# EAGLE schematic main (EAGLE 9.3.0)

## Sheet 1 of 8: ADC
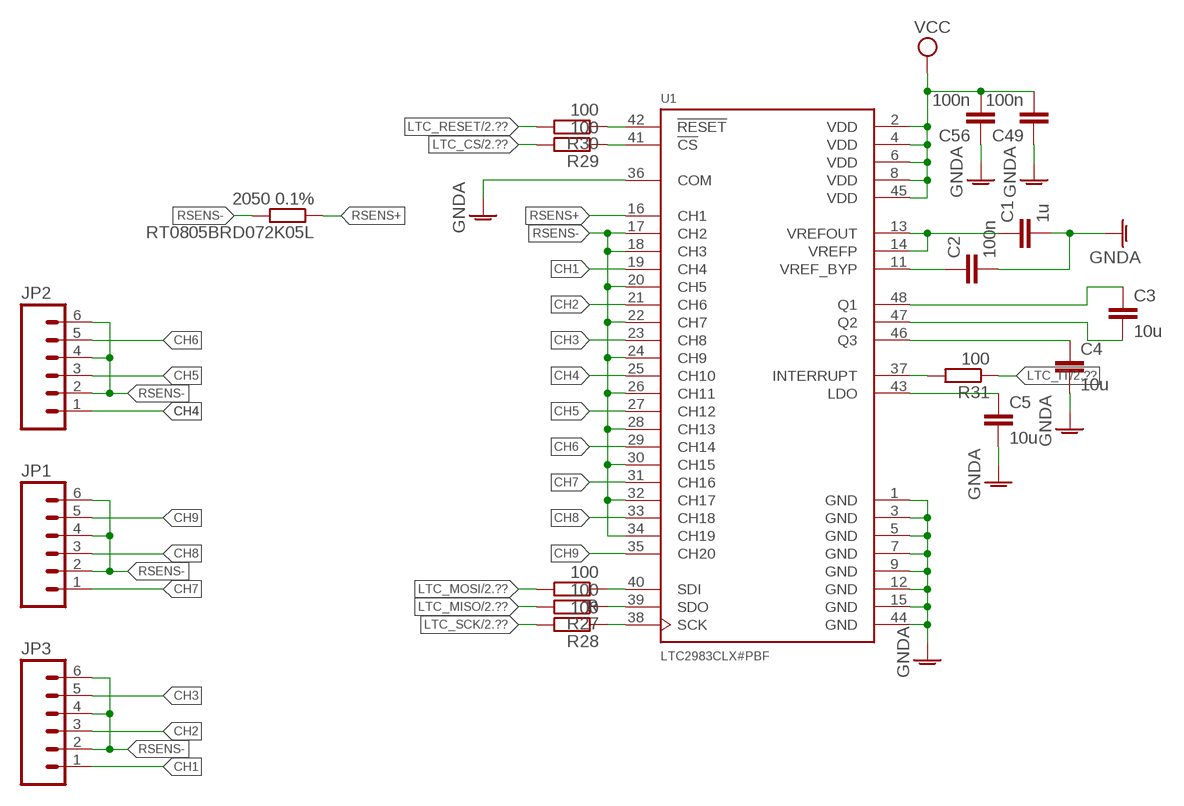
[diagram p0: schematic, sheet 1]

### Parts
C1  1u  C-EUC0603K  [C0603K]
C2  100n  C-EUC0603K  [C0603K]
C3  10u  C-EUC0805K  [C0805K]
C4  10u  C-EUC0805K  [C0805K]
C5  10u  C-EUC0805K  [C0805K]
C49  100n  C-EUC0603K  [C0603K]
C56  100n  C-EUC0603K  [C0603K]
JP1  M063.5MM-6  [SCREWTERMINAL-3.5MM-6]
JP2  M063.5MM-6  [SCREWTERMINAL-3.5MM-6]
JP3  M063.5MM-6  [SCREWTERMINAL-3.5MM-6]
R  100  R-EU_R0603  [R0603]
R27  100  R-EU_R0603  [R0603]
R28  100  R-EU_R0603  [R0603]
R29  100  R-EU_R0603  [R0603]
R30  100  R-EU_R0603  [R0603]
R31  100  R-EU_R0603  [R0603]
RT0805BRD072K05L  2050 0.1%  R-EU_R0805  [R0805]
U1  LTC2983CLX#PBF  [QFP50P900X900X160-48N]

### Nets
CH1: JP3.1 U1.19(CH4)
CH2: JP3.3 U1.21(CH6)
CH3: JP3.5 U1.23(CH8)
CH4: JP2.1 U1.25(CH10)
CH5: JP2.3 U1.27(CH12)
CH6: JP2.5 U1.29(CH14)
CH7: JP1.1 U1.31(CH16)
CH8: JP1.3 U1.33(CH18)
CH9: JP1.5 U1.35(CH20)
GNDA: C1.2 C2.2 C4.2 C5.2 C49.1 C56.1 U1.1(GND) U1.3(GND) U1.5(GND) U1.7(GND) U1.9(GND) U1.12(GND) U1.15(GND) U1.36(COM) U1.44(GND) ; also sheet 2,3,4
LTC_CS: R29.2 ; also sheet 2
LTC_IT: R31.1 ; also sheet 2
LTC_MISO: R27.2 ; also sheet 2
LTC_MOSI: R.2 ; also sheet 2
LTC_RESET: R30.2 ; also sheet 2
LTC_SCK: R28.2 ; also sheet 2
N$1: R31.2 U1.37(INTERRUPT)
N$5: C1.1 U1.13(VREFOUT) U1.14(VREFP)
N$7: C2.1 U1.11(VREF_BYP)
N$11: C3.1 U1.48(Q1)
N$13: C3.2 U1.47(Q2)
N$15: C4.1 U1.46(Q3)
N$17: C5.1 U1.43(LDO)
N$22: R30.1 U1.42(!RESET!)
N$26: R29.1 U1.41(!CS!)
N$27: R.1 U1.40(SDI)
N$41: R27.1 U1.39(SDO)
N$44: R28.1 U1.38(SCK)
RSENS+: RT0805BRD072K05L.1 U1.16(CH1)
RSENS-: JP1.2 JP1.4 JP1.6 JP2.2 JP2.4 JP2.6 JP3.2 JP3.4 JP3.6 RT0805BRD072K05L.2 U1.17(CH2) U1.18(CH3) U1.20(CH5) U1.22(CH7) U1.24(CH9) U1.26(CH11) U1.28(CH13) U1.30(CH15) U1.32(CH17) U1.34(CH19)
VCC: C49.2 C56.2 U1.2(VDD) U1.4(VDD) U1.6(VDD) U1.8(VDD) U1.45(VDD) ; also sheet 2,4

## Sheet 2 of 8: MCU
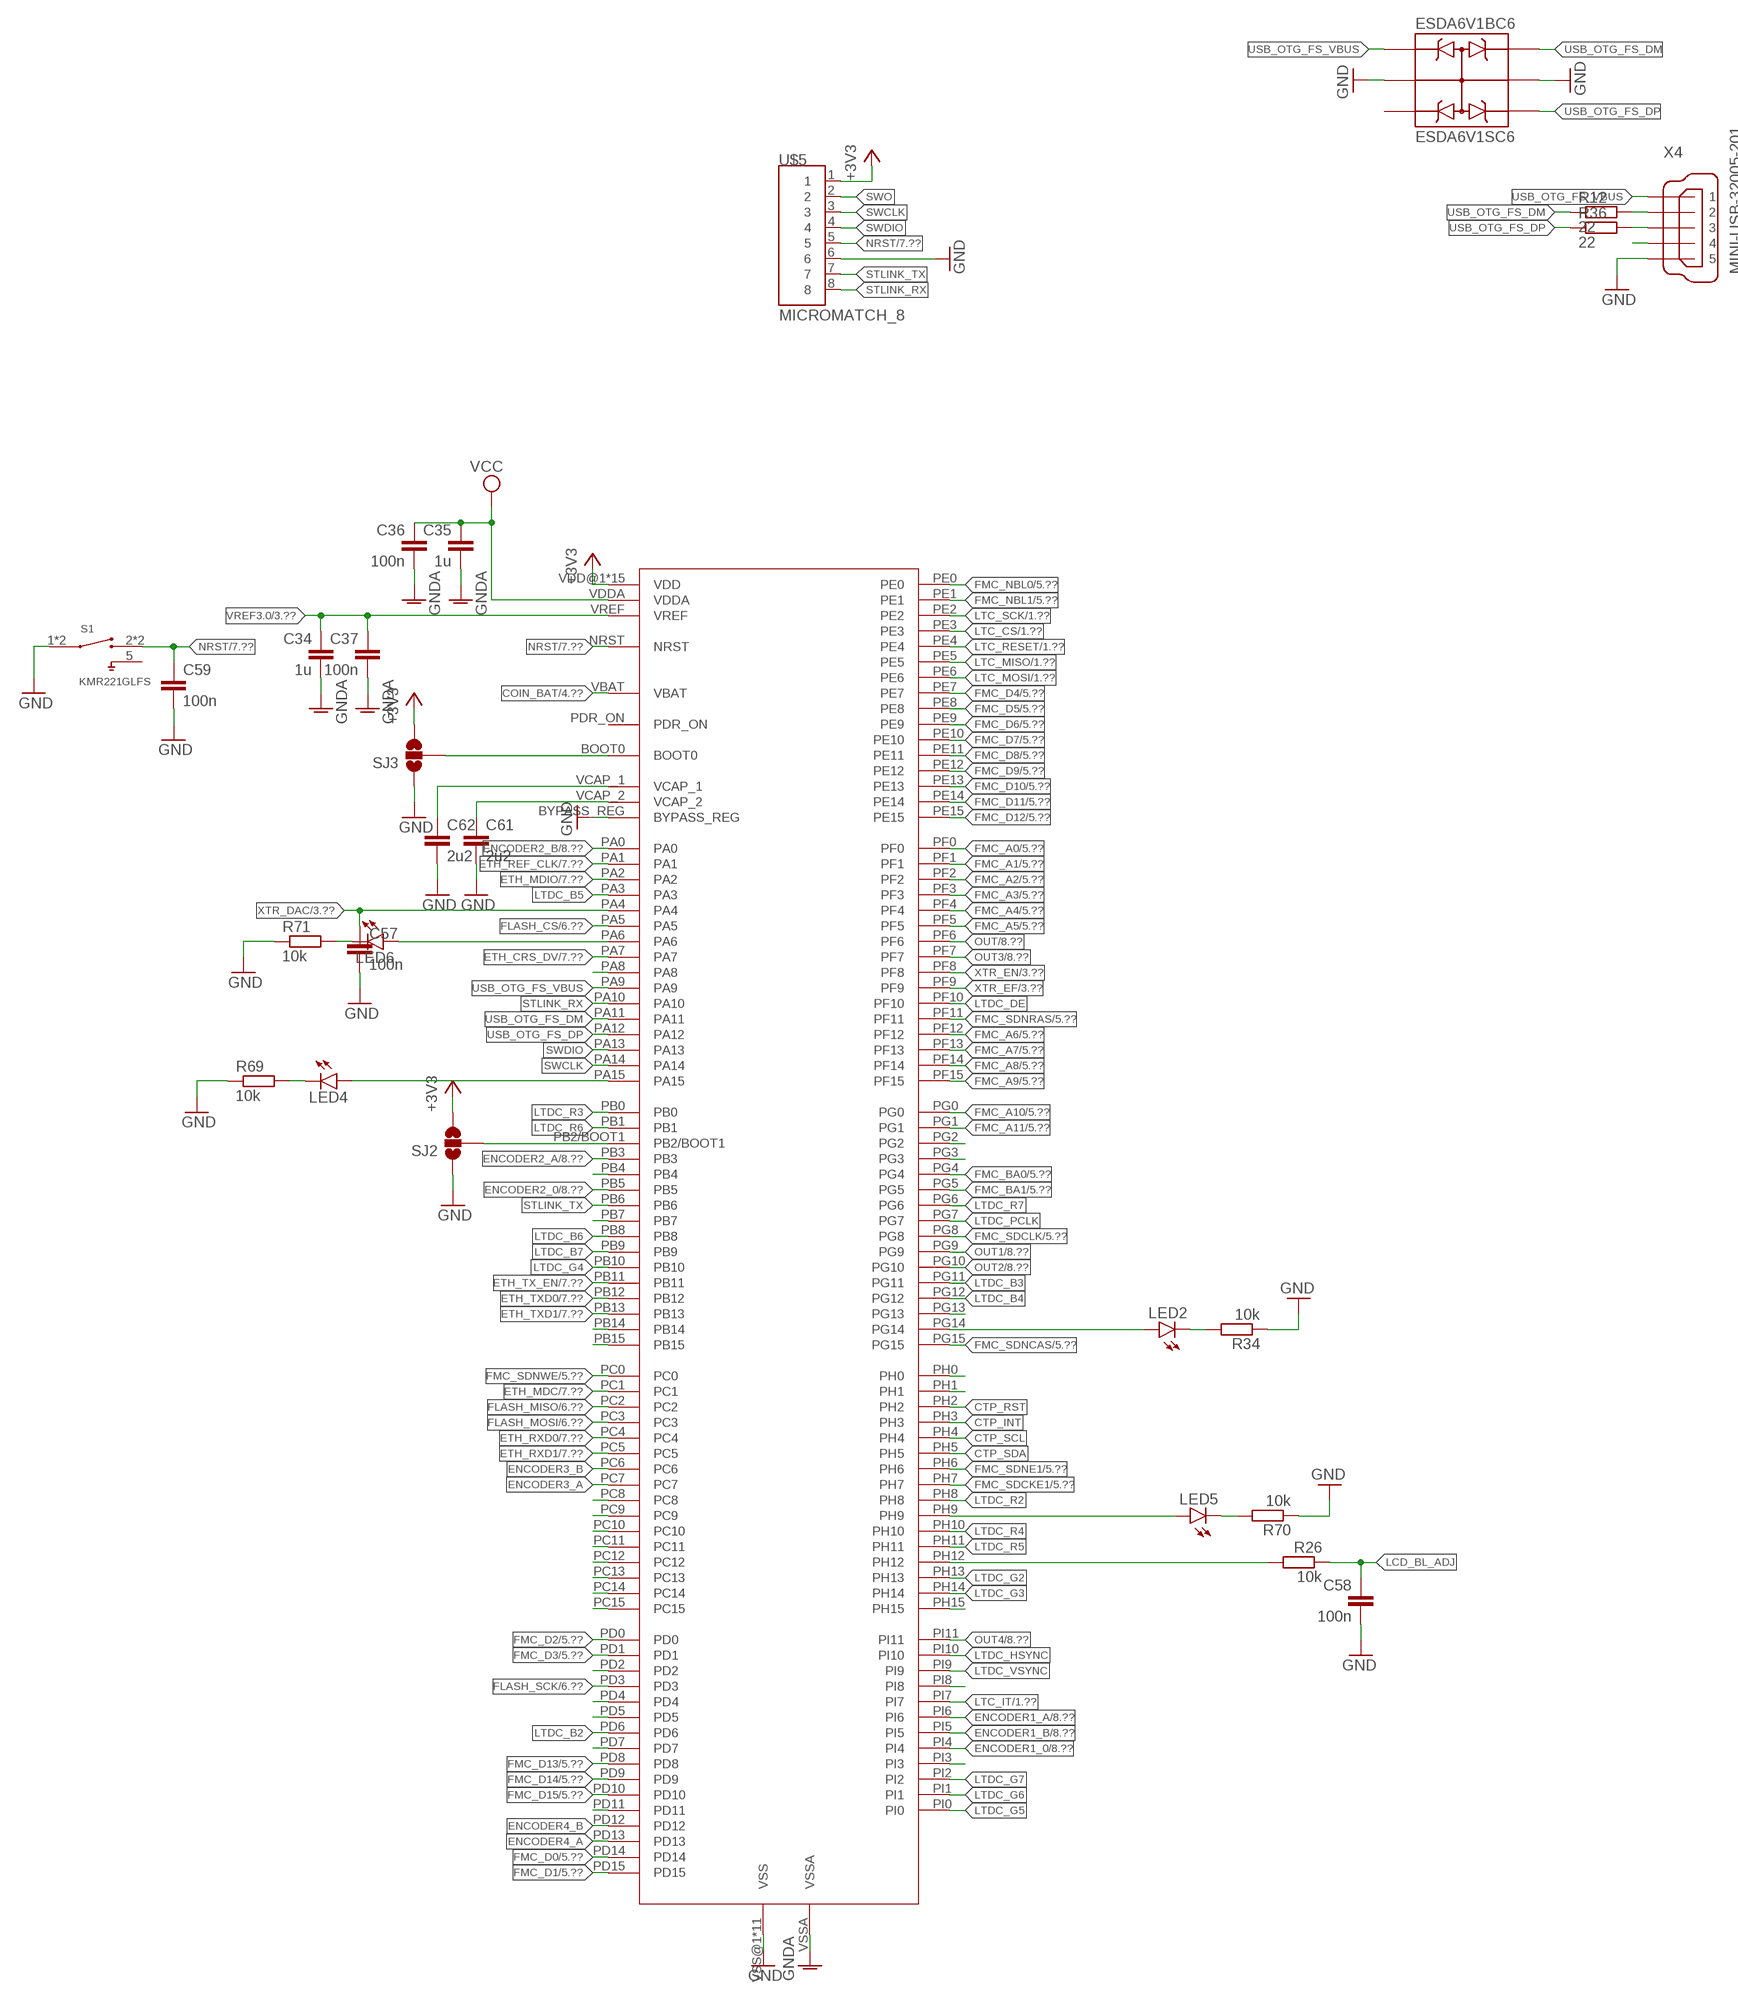
[diagram p1: schematic, sheet 2, part 1 of 2]
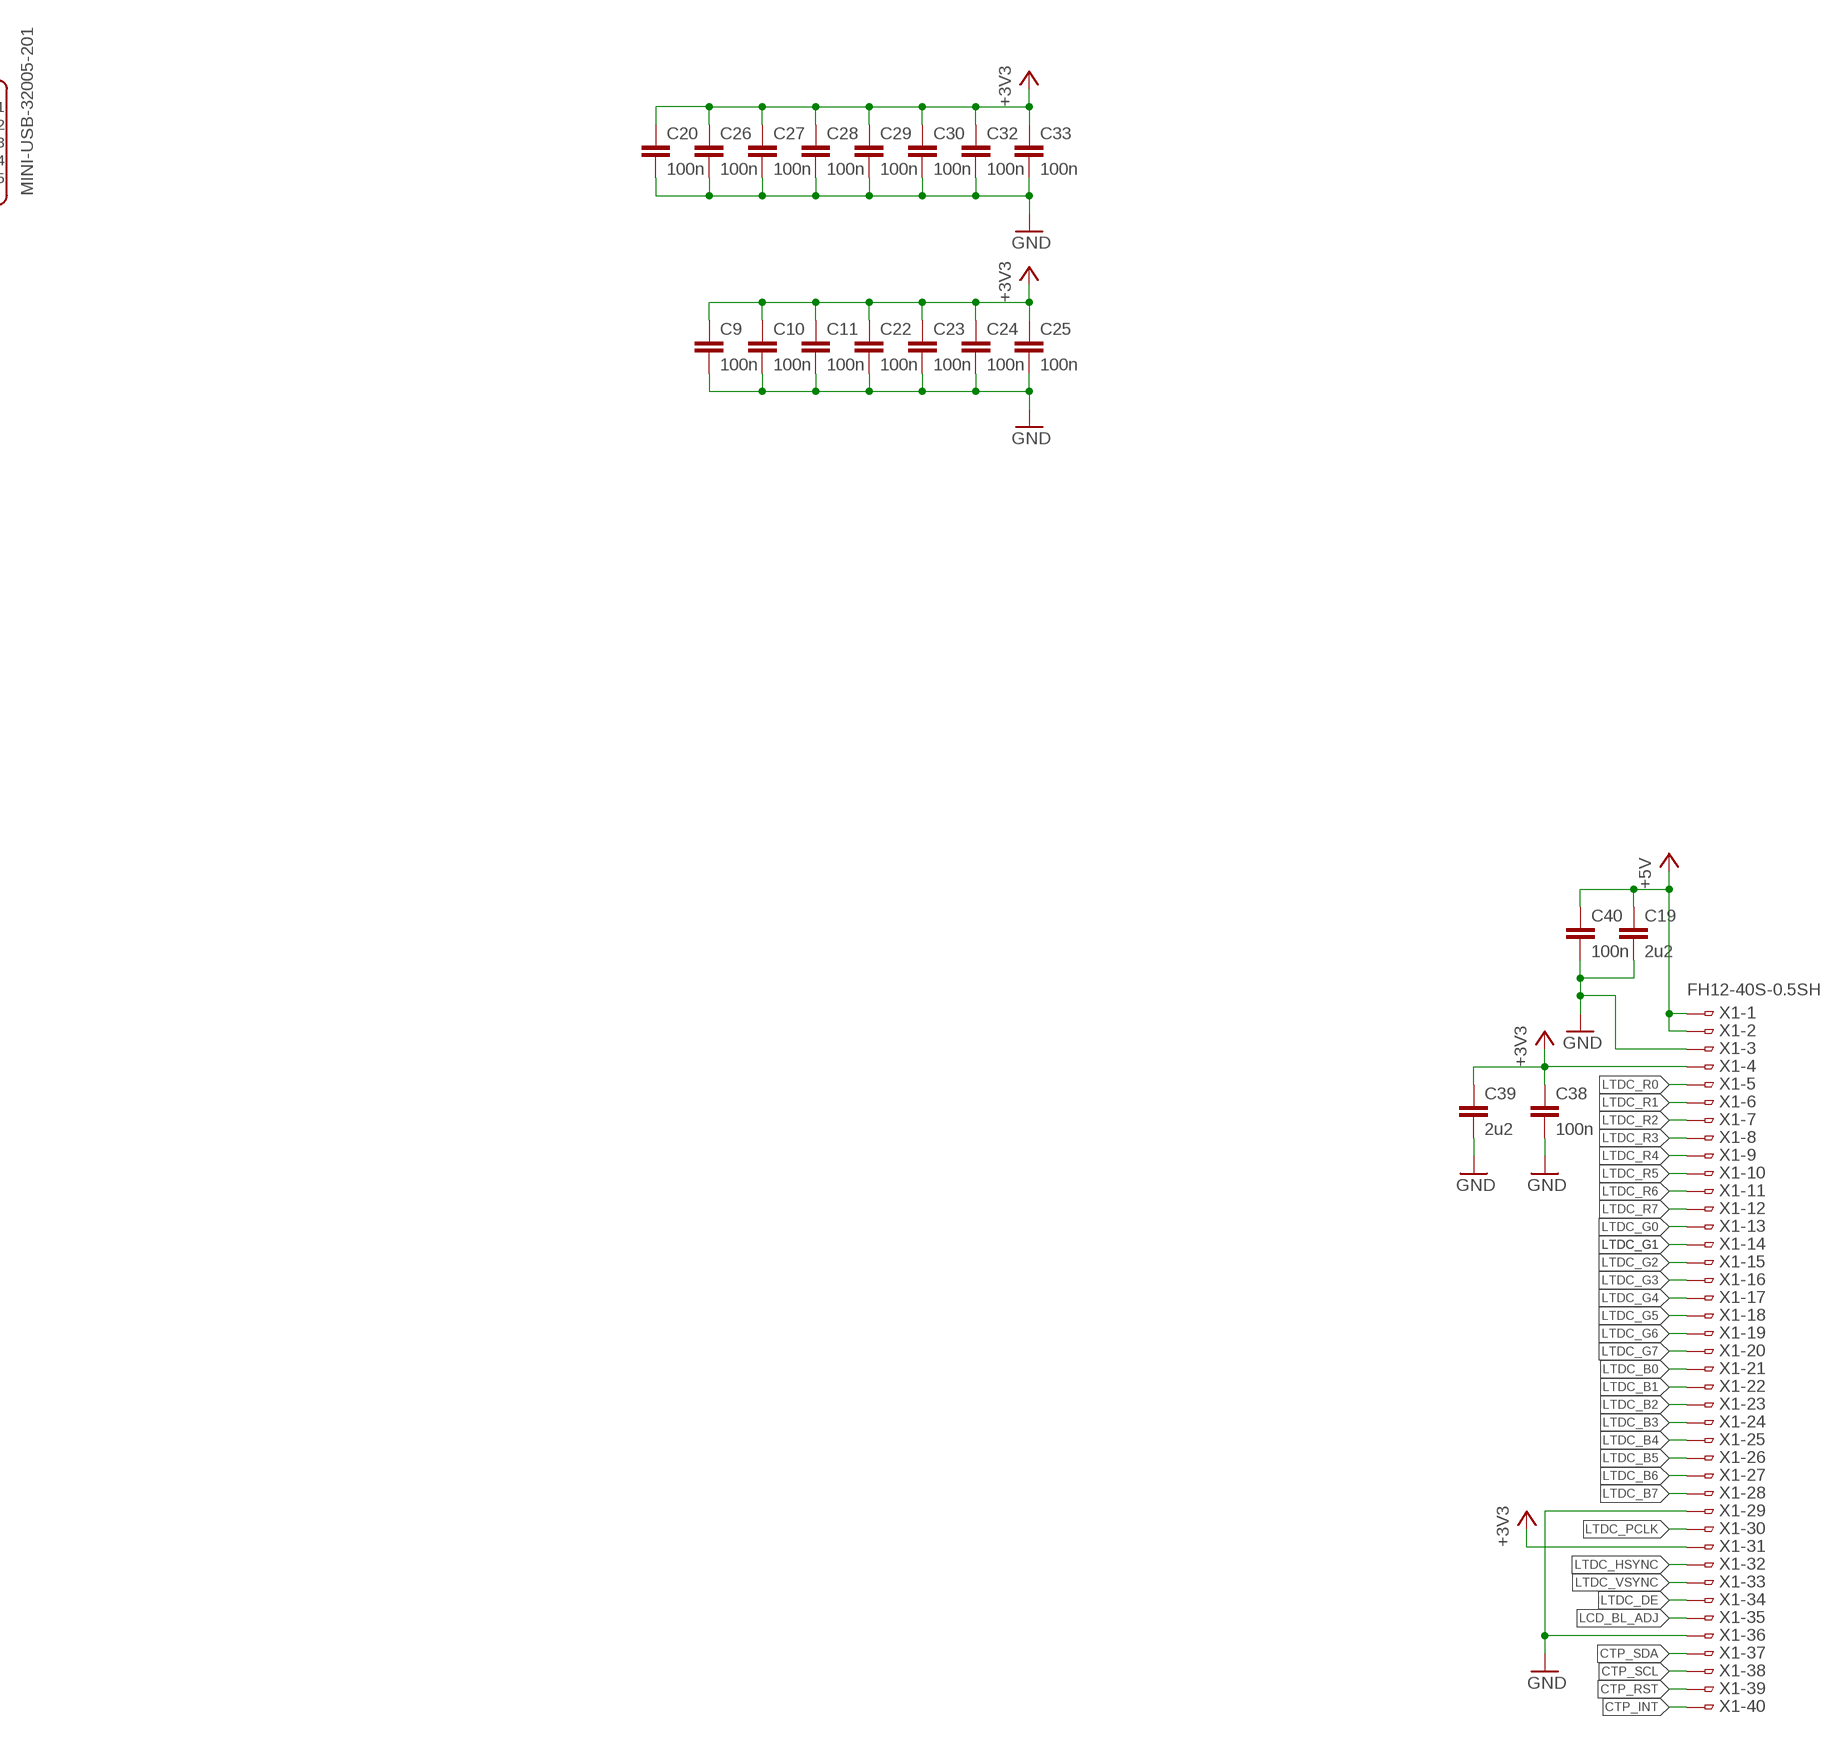
[diagram p2: schematic, sheet 2, part 2 of 2]

### Parts
C9  100n  C-EUC0603K  [C0603K]
C10  100n  C-EUC0603K  [C0603K]
C11  100n  C-EUC0603K  [C0603K]
C19  2u2  C-EUC0805K  [C0805K]
C20  100n  C-EUC0603K  [C0603K]
C22  100n  C-EUC0603K  [C0603K]
C23  100n  C-EUC0603K  [C0603K]
C24  100n  C-EUC0603K  [C0603K]
C25  100n  C-EUC0603K  [C0603K]
C26  100n  C-EUC0603K  [C0603K]
C27  100n  C-EUC0603K  [C0603K]
C28  100n  C-EUC0603K  [C0603K]
C29  100n  C-EUC0603K  [C0603K]
C30  100n  C-EUC0603K  [C0603K]
C32  100n  C-EUC0603K  [C0603K]
C33  100n  C-EUC0603K  [C0603K]
C34  1u  C-EUC0805K  [C0805K]
C35  1u  C-EUC0805K  [C0805K]
C36  100n  C-EUC0603K  [C0603K]
C37  100n  C-EUC0603K  [C0603K]
C38  100n  C-EUC0805  [C0805]
C39  2u2  C-EUC0805K  [C0805K]
C40  100n  C-EUC0805  [C0805]
C57  100n  C-EUC0603K  [C0603K]
C58  100n  C-EUC0603K  [C0603K]
C59  100n  C-EUC0603K  [C0603K]
C61  2u2  C-EUC0805K  [C0805K]
C62  2u2  C-EUC0805K  [C0805K]
ESDA6V1BC6  ESDA6V1SC6  [SOT95P280X145-6N]
LED2  LEDCHIPLED_0603  [CHIPLED_0603]
LED4  LEDCHIPLED_0603  [CHIPLED_0603]
LED5  LEDCHIPLED_0603  [CHIPLED_0603]
LED6  LEDCHIPLED_0603  [CHIPLED_0603]
R12  22  R-EU_R0603  [R0603]
R26  10k  R-EU_R0603  [R0603]
R34  10k  R-EU_R0603  [R0603]
R36  22  R-EU_R0603  [R0603]
R69  10k  R-EU_R0603  [R0603]
R70  10k  R-EU_R0603  [R0603]
R71  10k  R-EU_R0603  [R0603]
S1  KMR221GLFS  [SW_KMR221GLFS]
SJ2  SOLDERJUMPER_2WAYS  [SJ_3]
SJ3  SOLDERJUMPER_2WAYS  [SJ_3]
U$3  STM32F429_176  [QFP50P2600X2600X160-176N]
U$5  MICROMATCH_8  [MICROMATCH_8]
X1  FH12-40S-0.5SH  [FH12-40S-0.5SH]
X4  MINI-USB-32005-201  [32005-201]

### Nets
+3V3: C9.1 C10.1 C11.1 C20.1 C22.1 C23.1 C24.1 C25.1 C26.1 C27.1 C28.1 C29.1 C30.1 C32.1 C33.1 C38.1 C39.1 SJ2.3 SJ3.3 U$3.VDD@1(VDD) U$3.VDD@2(VDD) U$3.VDD@3(VDD) U$3.VDD@4(VDD) U$3.VDD@5(VDD) U$3.VDD@6(VDD) U$3.VDD@7(VDD) U$3.VDD@8(VDD) U$3.VDD@9(VDD) U$3.VDD@10(VDD) U$3.VDD@11(VDD) U$3.VDD@12(VDD) U$3.VDD@13(VDD) U$3.VDD@14(VDD) U$3.VDD@15(VDD) U$5.1 X1.4 X1.31 ; also sheet 4,5,6,7,8
+5V: C19.1 C40.1 X1.1 X1.2 ; also sheet 4,8
COIN_BAT: U$3.VBAT ; also sheet 4
CTP_INT: U$3.PH3 X1.40
CTP_RST: U$3.PH2 X1.39
CTP_SCL: U$3.PH4 X1.38
CTP_SDA: U$3.PH5 X1.37
ENCODER1_0: U$3.PI4 ; also sheet 8
ENCODER1_A: U$3.PI6 ; also sheet 8
ENCODER1_B: U$3.PI5 ; also sheet 8
ENCODER2_0: U$3.PB5 ; also sheet 8
ENCODER2_A: U$3.PB3 ; also sheet 8
ENCODER2_B: U$3.PA0 ; also sheet 8
ENCODER3_A: U$3.PC7
ENCODER3_B: U$3.PC6
ENCODER4_A: U$3.PD13
ENCODER4_B: U$3.PD12
ETH_CRS_DV: U$3.PA7 ; also sheet 7
ETH_MDC: U$3.PC1 ; also sheet 7
ETH_MDIO: U$3.PA2 ; also sheet 7
ETH_REF_CLK: U$3.PA1 ; also sheet 7
ETH_RXD0: U$3.PC4 ; also sheet 7
ETH_RXD1: U$3.PC5 ; also sheet 7
ETH_TX_EN: U$3.PB11 ; also sheet 7
ETH_TXD0: U$3.PB12 ; also sheet 7
ETH_TXD1: U$3.PB13 ; also sheet 7
FLASH_CS: U$3.PA5 ; also sheet 6
FLASH_MISO: U$3.PC2 ; also sheet 6
FLASH_MOSI: U$3.PC3 ; also sheet 6
FLASH_SCK: U$3.PD3 ; also sheet 6
FMC_A0: U$3.PF0 ; also sheet 5
FMC_A1: U$3.PF1 ; also sheet 5
FMC_A2: U$3.PF2 ; also sheet 5
FMC_A3: U$3.PF3 ; also sheet 5
FMC_A4: U$3.PF4 ; also sheet 5
FMC_A5: U$3.PF5 ; also sheet 5
FMC_A6: U$3.PF12 ; also sheet 5
FMC_A7: U$3.PF13 ; also sheet 5
FMC_A8: U$3.PF14 ; also sheet 5
FMC_A9: U$3.PF15 ; also sheet 5
FMC_A10: U$3.PG0 ; also sheet 5
FMC_A11: U$3.PG1 ; also sheet 5
FMC_BA0: U$3.PG4 ; also sheet 5
FMC_BA1: U$3.PG5 ; also sheet 5
FMC_D0: U$3.PD14 ; also sheet 5
FMC_D1: U$3.PD15 ; also sheet 5
FMC_D2: U$3.PD0 ; also sheet 5
FMC_D3: U$3.PD1 ; also sheet 5
FMC_D4: U$3.PE7 ; also sheet 5
FMC_D5: U$3.PE8 ; also sheet 5
FMC_D6: U$3.PE9 ; also sheet 5
FMC_D7: U$3.PE10 ; also sheet 5
FMC_D8: U$3.PE11 ; also sheet 5
FMC_D9: U$3.PE12 ; also sheet 5
FMC_D10: U$3.PE13 ; also sheet 5
FMC_D11: U$3.PE14 ; also sheet 5
FMC_D12: U$3.PE15 ; also sheet 5
FMC_D13: U$3.PD8 ; also sheet 5
FMC_D14: U$3.PD9 ; also sheet 5
FMC_D15: U$3.PD10 ; also sheet 5
FMC_NBL0: U$3.PE0 ; also sheet 5
FMC_NBL1: U$3.PE1 ; also sheet 5
FMC_SDCKE1: U$3.PH7 ; also sheet 5
FMC_SDCLK: U$3.PG8 ; also sheet 5
FMC_SDNCAS: U$3.PG15 ; also sheet 5
FMC_SDNE1: U$3.PH6 ; also sheet 5
FMC_SDNRAS: U$3.PF11 ; also sheet 5
FMC_SDNWE: U$3.PC0 ; also sheet 5
GND: C9.2 C10.2 C11.2 C19.2 C20.2 C22.2 C23.2 C24.2 C25.2 C26.2 C27.2 C28.2 C29.2 C30.2 C32.2 C33.2 C38.2 C39.2 C40.2 C57.2 C58.2 C59.2 C61.2 C62.2 ESDA6V1BC6.2 ESDA6V1BC6.5 R34.1 R69.1 R70.1 R71.1 S1.1 S1.4 SJ2.1 SJ3.1 U$3.BYPASS_REG U$3.VSS@1(VSS) U$3.VSS@2(VSS) U$3.VSS@3(VSS) U$3.VSS@4(VSS) U$3.VSS@5(VSS) U$3.VSS@7(VSS) U$3.VSS@8(VSS) U$3.VSS@9(VSS) U$3.VSS@10(VSS) U$3.VSS@11(VSS) U$3.VSS@12(VSS) U$5.6 X1.3 X1.29 X1.36 X4.5 ; also sheet 3,4,5,6,7,8
GNDA: C34.2 C35.2 C36.2 C37.2 U$3.VSSA ; also sheet 1,3,4
LCD_BL_ADJ: C58.1 R26.1 X1.35
LTC_CS: U$3.PE3 ; also sheet 1
LTC_IT: U$3.PI7 ; also sheet 1
LTC_MISO: U$3.PE5 ; also sheet 1
LTC_MOSI: U$3.PE6 ; also sheet 1
LTC_RESET: U$3.PE4 ; also sheet 1
LTC_SCK: U$3.PE2 ; also sheet 1
LTDC_B0: X1.21
LTDC_B1: X1.22
LTDC_B2: U$3.PD6 X1.23
LTDC_B3: U$3.PG11 X1.24
LTDC_B4: U$3.PG12 X1.25
LTDC_B5: U$3.PA3 X1.26
LTDC_B6: U$3.PB8 X1.27
LTDC_B7: U$3.PB9 X1.28
LTDC_DE: U$3.PF10 X1.34
LTDC_G0: X1.13
LTDC_G1: X1.14
LTDC_G2: U$3.PH13 X1.15
LTDC_G3: U$3.PH14 X1.16
LTDC_G4: U$3.PB10 X1.17
LTDC_G5: U$3.PI0 X1.18
LTDC_G6: U$3.PI1 X1.19
LTDC_G7: U$3.PI2 X1.20
LTDC_HSYNC: U$3.PI10 X1.32
LTDC_PCLK: U$3.PG7 X1.30
LTDC_R0: X1.5
LTDC_R1: X1.6
LTDC_R2: U$3.PH8 X1.7
LTDC_R3: U$3.PB0 X1.8
LTDC_R4: U$3.PH10 X1.9
LTDC_R5: U$3.PH11 X1.10
LTDC_R6: U$3.PB1 X1.11
LTDC_R7: U$3.PG6 X1.12
LTDC_VSYNC: U$3.PI9 X1.33
N$3: LED4.A U$3.PA15
N$28: LED6.A U$3.PA6
N$34: R12.2 X4.2
N$35: R36.2 X4.3
N$36: LED2.A U$3.PG14
N$38: X4.4
N$43: LED4.C R69.2
N$55: LED2.C R34.2
N$58: SJ3.2 U$3.BOOT0
N$59: C62.1 U$3.VCAP_1
N$60: C61.1 U$3.VCAP_2
N$69: U$3.PA8
N$74: LED5.A U$3.PH9
N$78: SJ2.2 U$3.PB2/BOOT1
N$79: U$3.PB4
N$82: U$3.PB7
N$87: LED5.C R70.2
N$89: U$3.PB14
N$90: U$3.PB15
N$93: LED6.C R71.2
N$99: U$3.PC8
N$100: U$3.PC9
N$101: U$3.PC10
N$102: U$3.PC11
N$103: U$3.PC12
N$104: U$3.PC13
N$105: U$3.PC14
N$106: U$3.PC15
N$109: U$3.PD2
N$111: U$3.PD4
N$112: U$3.PD5
N$114: U$3.PD7
N$118: U$3.PD11
N$126: U$3.PI3
N$131: U$3.PI8
N$135: U$3.PH15
N$138: R26.2 U$3.PH12
N$149: U$3.PH1
N$150: U$3.PH0
N$153: U$3.PG13
N$163: U$3.PG3
N$164: U$3.PG2
NRST: C59.1 S1.2 S1.3 U$3.NRST U$5.5 ; also sheet 7
OUT: U$3.PF6 ; also sheet 8
OUT1: U$3.PG9 ; also sheet 8
OUT2: U$3.PG10 ; also sheet 8
OUT3: U$3.PF7 ; also sheet 8
OUT4: U$3.PI11 ; also sheet 8
STLINK_RX: U$3.PA10 U$5.8
STLINK_TX: U$3.PB6 U$5.7
SWCLK: U$3.PA14 U$5.3
SWDIO: U$3.PA13 U$5.4
SWO: U$5.2
USB_OTG_FS_DM: ESDA6V1BC6.6 R12.1 U$3.PA11
USB_OTG_FS_DP: ESDA6V1BC6.4 R36.1 U$3.PA12
USB_OTG_FS_VBUS: ESDA6V1BC6.1 U$3.PA9 X4.1
VCC: C35.1 C36.1 U$3.VDDA ; also sheet 1,4
VREF3.0: C34.1 C37.1 U$3.VREF ; also sheet 3
XTR_DAC: C57.1 U$3.PA4 ; also sheet 3
XTR_EF: U$3.PF9 ; also sheet 3
XTR_EN: U$3.PF8 ; also sheet 3
Unconnected: ESDA6V1BC6.3 S1.5 U$3.PDR_ON

## Sheet 3 of 8: current
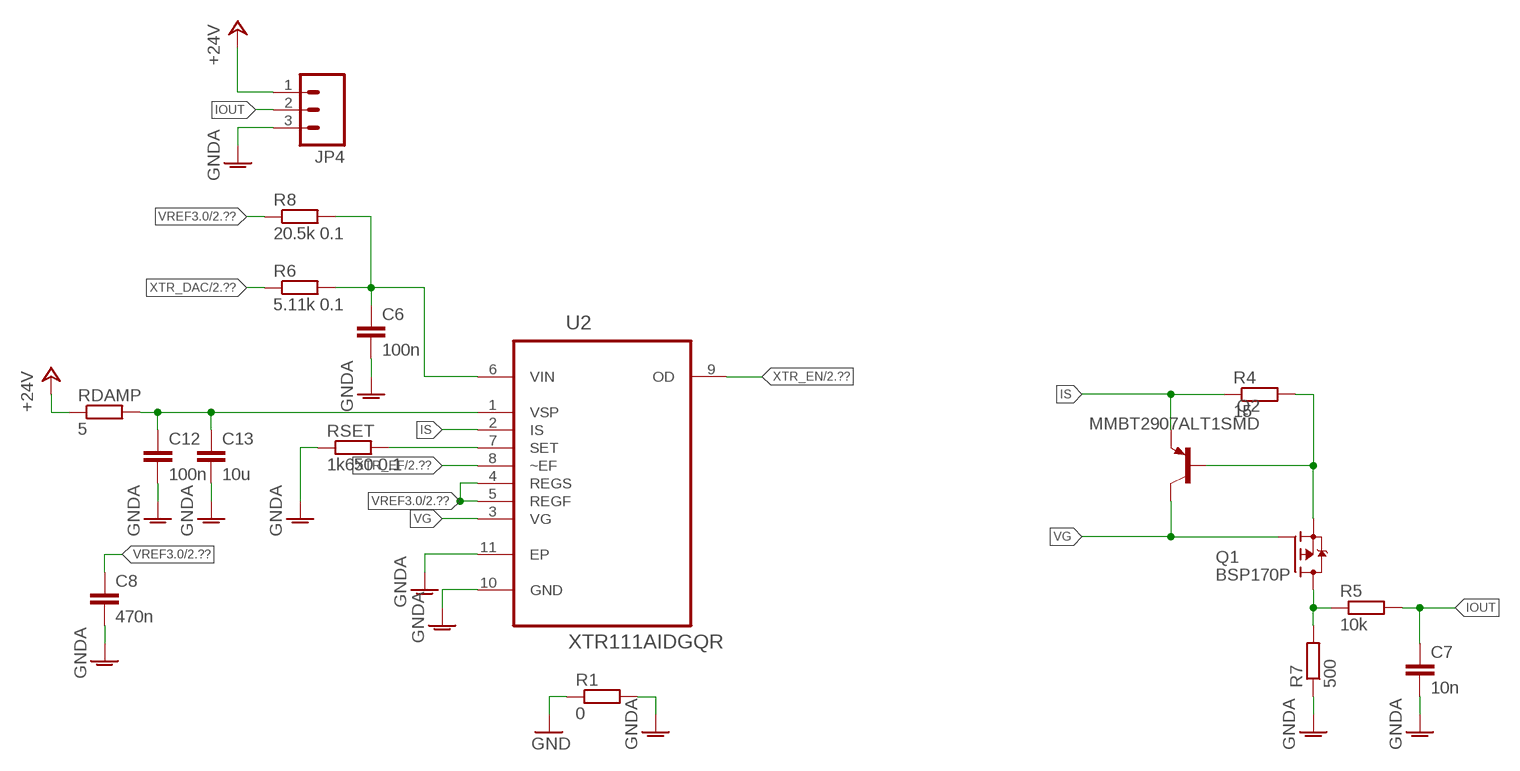
[diagram p3: schematic, sheet 3]

### Parts
C6  100n  C-EUC0603K  [C0603K]
C7  10n  C-EUC0603K  [C0603K]
C8  470n  C-EUC0603K  [C0603K]
C12  100n  C-EUC0603K  [C0603K]
C13  10u  C-EUC0805  [C0805]
JP4  M03SCREW  [SCREWTERMINAL-3.5MM-3]
Q1  BSP170P  [SOT223]
Q2  MMBT2907ALT1SMD  [SOT23-BEC]
R1  0  R-EU_R0603  [R0603]
R4  15  R-EU_R0603  [R0603]
R5  10k  R-EU_R0603  [R0603]
R6  5.11k 0.1  R-EU_R0805  [R0805]
R7  500  R-EU_R0603  [R0603]
R8  20.5k 0.1  R-EU_R0805  [R0805]
RDAMP  5  R-EU_R0603  [R0603]
RSET  1k650 0.1  R-EU_R0805  [R0805]
U2  XTR111AIDGQR  [SOP50P490X120-15N]

### Nets
+24V: JP4.1 RDAMP.1 ; also sheet 4
GND: R1.1 ; also sheet 2,4,5,6,7,8
GNDA: C6.2 C7.2 C8.2 C12.2 C13.2 JP4.3 R1.2 R7.1 RSET.1 U2.10(GND) U2.11(EP) ; also sheet 1,2,4
IOUT: C7.1 JP4.2 R5.2
IS: Q2.E R4.1 U2.2(IS)
N$9: Q1.3(S) Q2.B R4.2
N$19: C12.1 C13.1 RDAMP.2 U2.1(VSP)
N$23: Q1.2(D) Q1.4(D) R5.1 R7.2
N$24: RSET.2 U2.7(SET)
N$37: C6.1 R6.2 R8.2 U2.6(VIN)
VG: Q1.1(G) Q2.C U2.3(VG)
VREF3.0: C8.1 R8.1 U2.4(REGS) U2.5(REGF) ; also sheet 2
XTR_DAC: R6.1 ; also sheet 2
XTR_EF: U2.8(~EF) ; also sheet 2
XTR_EN: U2.9(OD) ; also sheet 2

## Sheet 4 of 8: supply
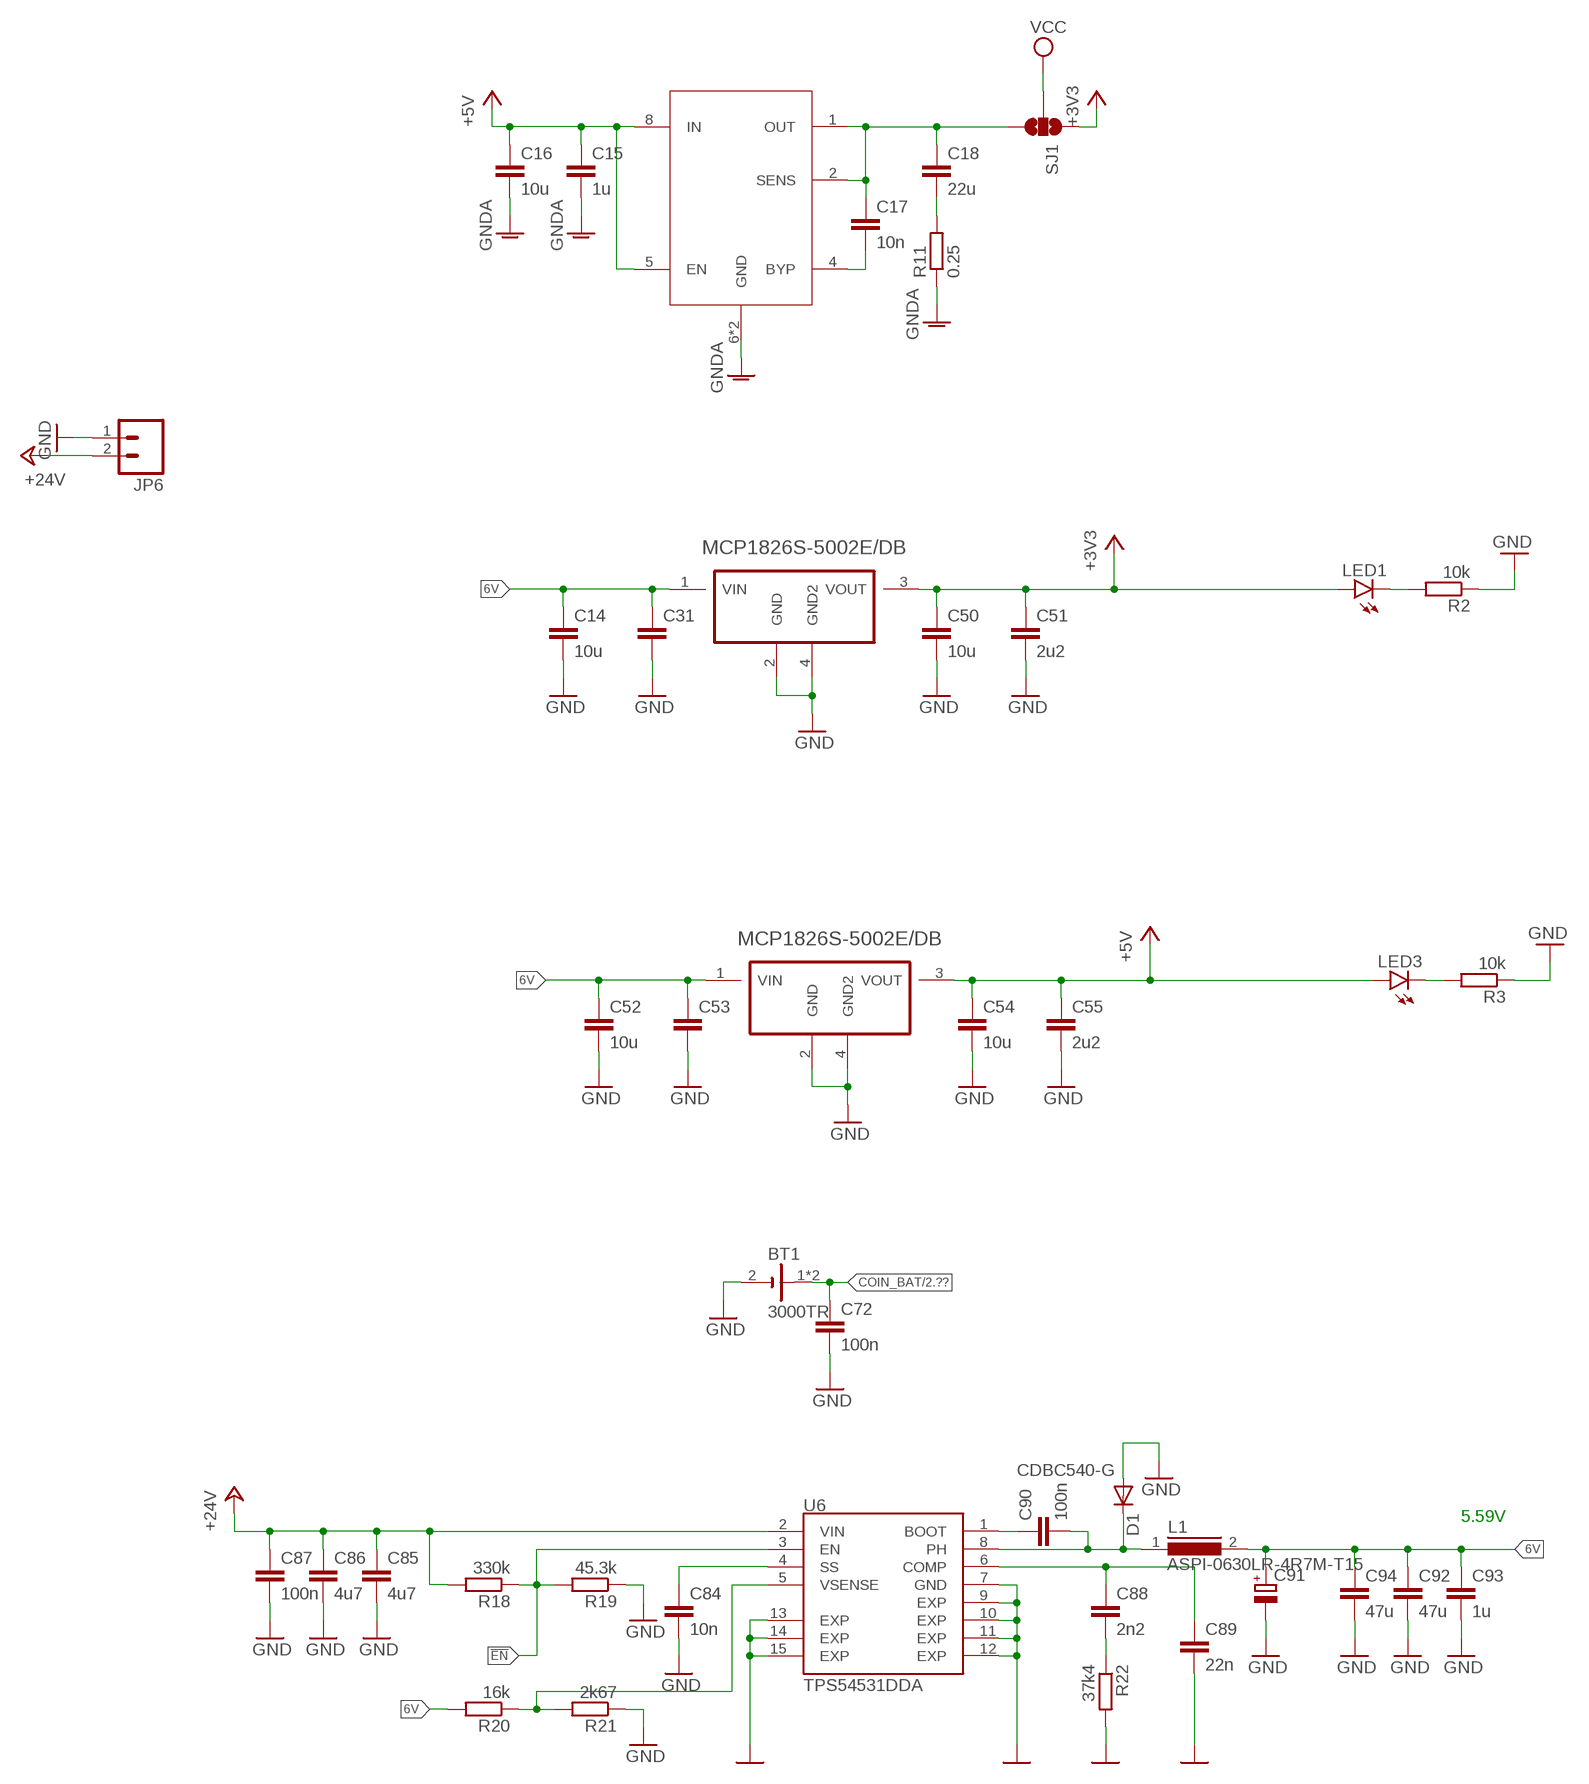
[diagram p4: schematic, sheet 4]

### Parts
BT1  3000TR  [BAT_3000TR]
C14  10u  C-EUC0805K  [C0805K]
C15  1u  C-EUC0805  [C0805]
C16  10u  C-EUC0805  [C0805]
C17  10n  C-EUC0603K  [C0603K]
C18  22u  C-EUC1206  [C1206]
C31  C-EUC0805K  [C0805K]
C50  10u  C-EUC0805K  [C0805K]
C51  2u2  C-EUC0805K  [C0805K]
C52  10u  C-EUC0805K  [C0805K]
C53  C-EUC0805K  [C0805K]
C54  10u  C-EUC0805K  [C0805K]
C55  2u2  C-EUC0805K  [C0805K]
C72  100n  C-EUC0603K  [C0603K]
C84  10n  C-EUC0603K  [C0603K]
C85  4u7  C-EUC0805K  [C0805K]
C86  4u7  C-EUC0805K  [C0805K]
C87  100n  C-EUC0603K  [C0603K]
C88  2n2  C-EUC0603K  [C0603K]
C89  22n  C-EUC0603K  [C0603K]
C90  100n  C-EUC0603K  [C0603K]
C91  CPOL-EUE5-6  [E5-6]
C92  47u  C-EUC1210  [C1210]
C93  1u  C-EUC0603K  [C0603K]
C94  47u  C-EUC1210  [C1210]
D1  CDBC540-G  DIODE-SMB  [SMB]
JP6  M023.5MM-NO_SILK  [SCREWTERMINAL-3.5MM-2-NS]
L1  ASPI-0630LR-4R7M-T15  DR74  [DR74]
LED1  LEDCHIPLED_0603  [CHIPLED_0603]
LED3  LEDCHIPLED_0603  [CHIPLED_0603]
R2  10k  R-EU_R0603  [R0603]
R3  10k  R-EU_R0603  [R0603]
R11  0.25  R-EU_R0603  [R0603]
R18  330k  R-EU_R0603  [R0603]
R19  45.3k  R-EU_R0603  [R0603]
R20  16k  R-EU_R0603  [R0603]
R21  2k67  R-EU_R0603  [R0603]
R22  37k4  R-EU_R0603  [R0603]
SJ1  SOLDERJUMPER_2WAYS  [SJ_3]
U3  MCP1826S-5002E/DB  [SOT230P700X180-4N]
U5  MCP1826S-5002E/DB  [SOT230P700X180-4N]
U6  TPS54531DDA  [SOIC127P600X170-9N]
U$2  IFX5444  [SOIC8]

### Nets
6V: C14.1 C31.1 C52.1 C53.1 C91.+ C92.1 C93.1 C94.1 L1.2 R20.2 U3.1(VIN) U5.1(VIN)
!EN: R18.1 R19.2 U6.3(EN)
+3V3: C50.1 C51.1 LED1.A SJ1.1 U3.3(VOUT) ; also sheet 2,5,6,7,8
+5V: C15.1 C16.1 C54.1 C55.1 LED3.A U5.3(VOUT) U$2.5(EN) U$2.8(IN) ; also sheet 2,8
+24V: C85.1 C86.1 C87.1 JP6.2 R18.2 U6.2(VIN) ; also sheet 3
COIN_BAT: BT1.1(+) BT1.3(+) C72.1 ; also sheet 2
GND: BT1.2(-) C14.2 C31.2 C50.2 C51.2 C52.2 C53.2 C54.2 C55.2 C72.2 C84.2 C85.2 C86.2 C87.2 C89.2 C91.- C92.2 C93.2 C94.2 D1.A JP6.1 R2.1 R3.1 R19.1 R21.1 R22.2 U3.2(GND) U3.4(GND2) U5.2(GND) U5.4(GND2) U6.7(GND) U6.9(EXP) U6.10(EXP) U6.11(EXP) U6.12(EXP) U6.13(EXP) U6.14(EXP) U6.15(EXP) ; also sheet 2,3,5,6,7,8
GNDA: C15.2 C16.2 R11.1 U$2.6(GND) U$2.E(GND) ; also sheet 1,2,3
N$25: C18.2 R11.2
N$31: C17.2 U$2.4(BYP)
N$32: C17.1 C18.1 SJ1.3 U$2.1(OUT) U$2.2(SENS)
N$42: LED1.C R2.2
N$47: R20.1 R21.2 U6.5(VSENSE)
N$48: C84.1 U6.4(SS)
N$49: C88.1 C89.1 U6.6(COMP)
N$50: C88.2 R22.1
N$51: C90.1 U6.1(BOOT)
N$52: C90.2 D1.C L1.1 U6.8(PH)
N$86: LED3.C R3.2
VCC: SJ1.2 ; also sheet 1,2

### Notes on the sheet
- 5.59V

## Sheet 5 of 8
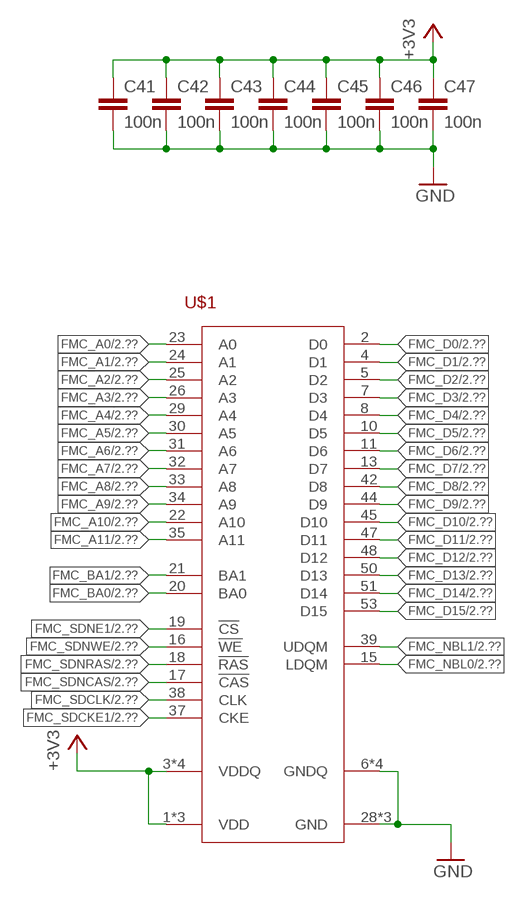
[diagram p5: schematic, sheet 5]

### Parts
C41  100n  C-EUC0603K  [C0603K]
C42  100n  C-EUC0603K  [C0603K]
C43  100n  C-EUC0603K  [C0603K]
C44  100n  C-EUC0603K  [C0603K]
C45  100n  C-EUC0603K  [C0603K]
C46  100n  C-EUC0603K  [C0603K]
C47  100n  C-EUC0603K  [C0603K]
U$1  IS45S16400J  [TSOP54]

### Nets
+3V3: C41.1 C42.1 C43.1 C44.1 C45.1 C46.1 C47.1 U$1.1(VDD) U$1.3(VDDQ) U$1.9(VDDQ) U$1.14(VDD) U$1.27(VDD) U$1.43(VDDQ) U$1.49(VDDQ) ; also sheet 2,4,6,7,8
FMC_A0: U$1.23(A0) ; also sheet 2
FMC_A1: U$1.24(A1) ; also sheet 2
FMC_A2: U$1.25(A2) ; also sheet 2
FMC_A3: U$1.26(A3) ; also sheet 2
FMC_A4: U$1.29(A4) ; also sheet 2
FMC_A5: U$1.30(A5) ; also sheet 2
FMC_A6: U$1.31(A6) ; also sheet 2
FMC_A7: U$1.32(A7) ; also sheet 2
FMC_A8: U$1.33(A8) ; also sheet 2
FMC_A9: U$1.34(A9) ; also sheet 2
FMC_A10: U$1.22(A10) ; also sheet 2
FMC_A11: U$1.35(A11) ; also sheet 2
FMC_BA0: U$1.20(BA0) ; also sheet 2
FMC_BA1: U$1.21(BA1) ; also sheet 2
FMC_D0: U$1.2(D0) ; also sheet 2
FMC_D1: U$1.4(D1) ; also sheet 2
FMC_D2: U$1.5(D2) ; also sheet 2
FMC_D3: U$1.7(D3) ; also sheet 2
FMC_D4: U$1.8(D4) ; also sheet 2
FMC_D5: U$1.10(D5) ; also sheet 2
FMC_D6: U$1.11(D6) ; also sheet 2
FMC_D7: U$1.13(D7) ; also sheet 2
FMC_D8: U$1.42(D8) ; also sheet 2
FMC_D9: U$1.44(D9) ; also sheet 2
FMC_D10: U$1.45(D10) ; also sheet 2
FMC_D11: U$1.47(D11) ; also sheet 2
FMC_D12: U$1.48(D12) ; also sheet 2
FMC_D13: U$1.50(D13) ; also sheet 2
FMC_D14: U$1.51(D14) ; also sheet 2
FMC_D15: U$1.53(D15) ; also sheet 2
FMC_NBL0: U$1.15(LDQM) ; also sheet 2
FMC_NBL1: U$1.39(UDQM) ; also sheet 2
FMC_SDCKE1: U$1.37(CKE) ; also sheet 2
FMC_SDCLK: U$1.38(CLK) ; also sheet 2
FMC_SDNCAS: U$1.17(!CAS) ; also sheet 2
FMC_SDNE1: U$1.19(!CS) ; also sheet 2
FMC_SDNRAS: U$1.18(!RAS) ; also sheet 2
FMC_SDNWE: U$1.16(!WE) ; also sheet 2
GND: C41.2 C42.2 C43.2 C44.2 C45.2 C46.2 C47.2 U$1.6(GNDQ) U$1.12(GNDQ) U$1.28(GND) U$1.41(GND) U$1.46(GNDQ) U$1.52(GNDQ) U$1.54(GND) ; also sheet 2,3,4,6,7,8

## Sheet 6 of 8
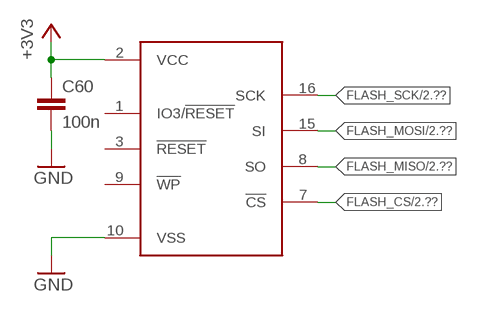
[diagram p6: schematic, sheet 6]

### Parts
C60  100n  C-EUC0603K  [C0603K]
U$4  S25FLX  [SOIC16]

### Nets
+3V3: C60.1 U$4.2(VCC) ; also sheet 2,4,5,7,8
FLASH_CS: U$4.7(!CS) ; also sheet 2
FLASH_MISO: U$4.8(SO) ; also sheet 2
FLASH_MOSI: U$4.15(SI) ; also sheet 2
FLASH_SCK: U$4.16(SCK) ; also sheet 2
GND: C60.2 U$4.10(VSS) ; also sheet 2,3,4,5,7,8
Unconnected: U$4.1(IO3/!RESET) U$4.3(!RESET) U$4.9(!WP)

## Sheet 7 of 8
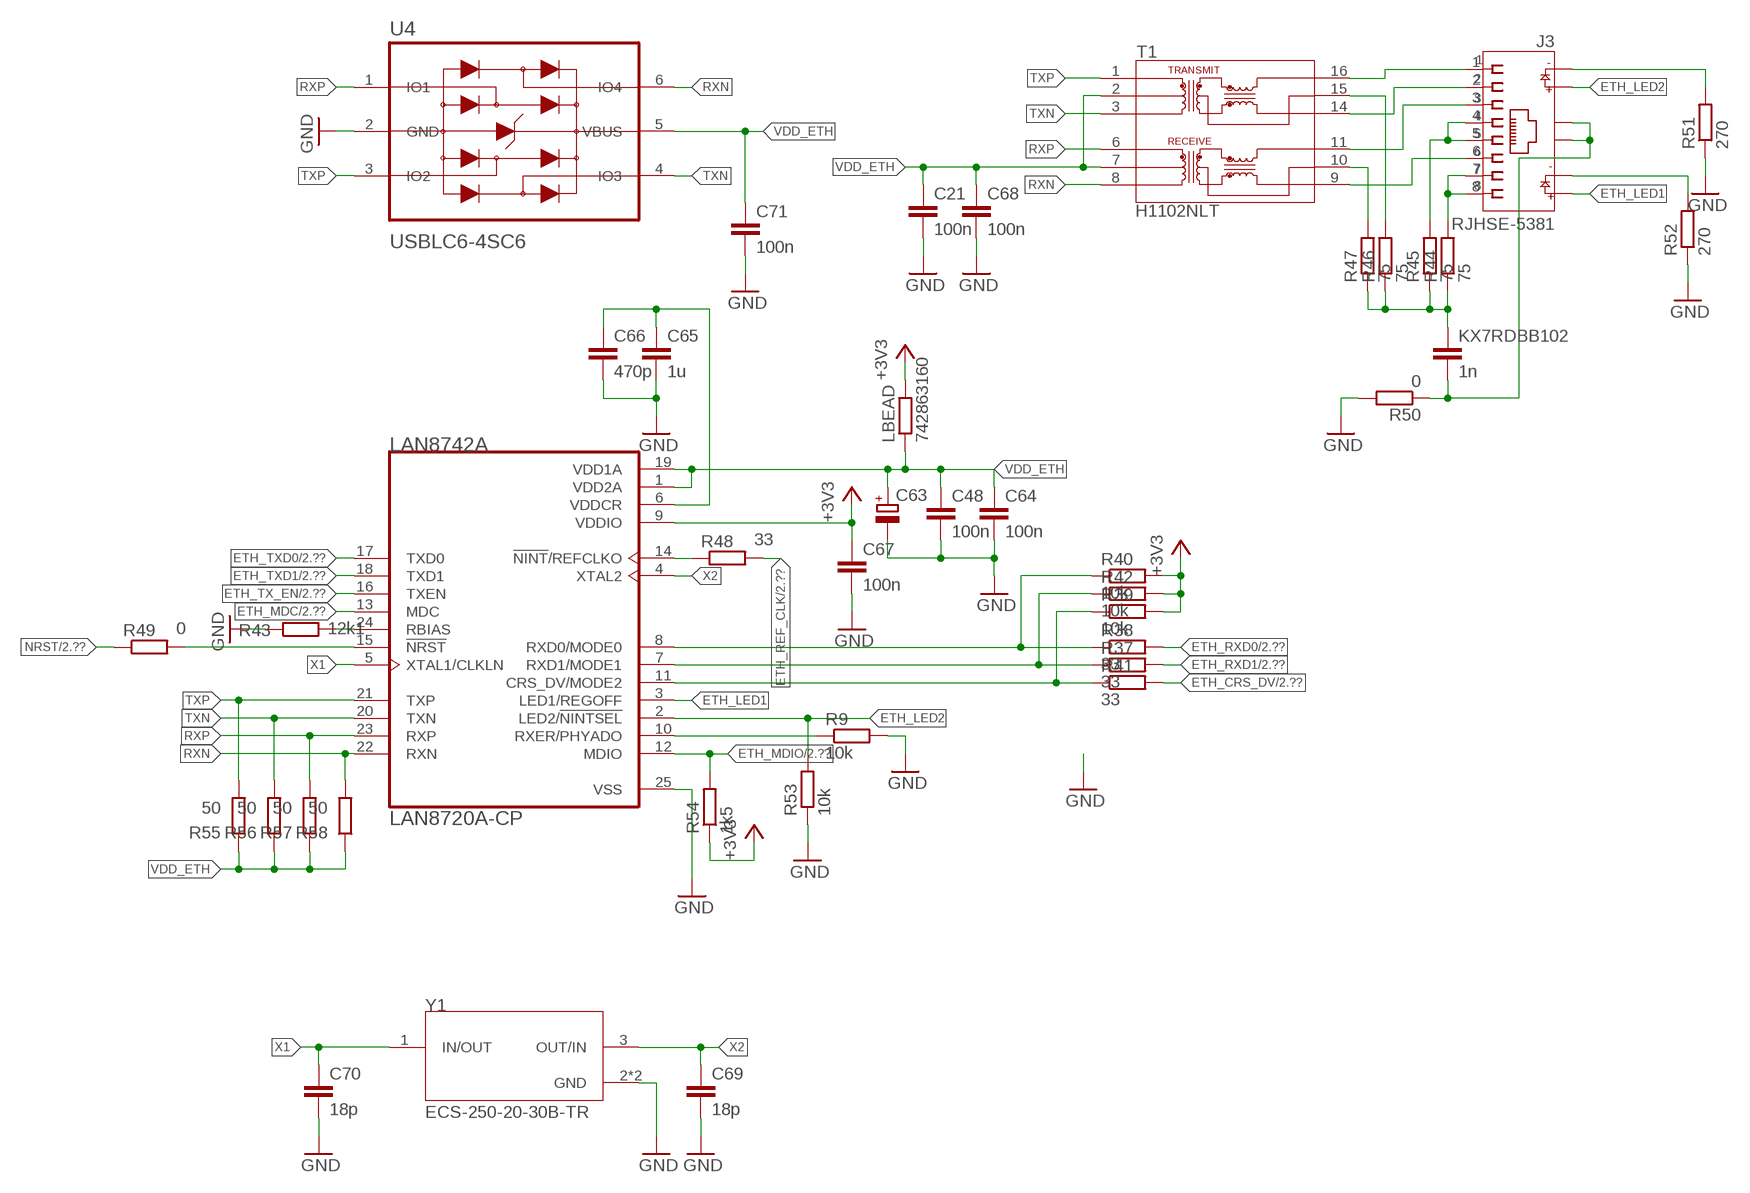
[diagram p7: schematic, sheet 7]

### Parts
C21  100n  C-EUC0603K  [C0603K]
C48  100n  C-EUC0603K  [C0603K]
C63  CPOL-EUSMCA  [SMC_A]
C64  100n  C-EUC0603K  [C0603K]
C65  1u  C-EUC0603K  [C0603K]
C66  470p  C-EUC0603K  [C0603K]
C67  100n  C-EUC0603K  [C0603K]
C68  100n  C-EUC0603K  [C0603K]
C69  18p  C-EUC0603K  [C0603K]
C70  18p  C-EUC0603K  [C0603K]
C71  100n  C-EUC0603K  [C0603K]
J3  RJHSE-5381  [AMPHENOL_RJHSE-5381]
KX7RDBB102  1n  C-EUC1206K  [C1206K]
LAN8742A  LAN8720A-CP  [QFN50P400X400X100-25N]
LBEAD  742863160  R-EU_R0603  [R0603]
R9  10k  R-EU_R0603  [R0603]
R37  33  R-EU_R0603  [R0603]
R38  33  R-EU_R0603  [R0603]
R39  10k  R-EU_R0603  [R0603]
R40  10k  R-EU_R0603  [R0603]
R41  33  R-EU_R0603  [R0603]
R42  10k  R-EU_R0603  [R0603]
R43  12k1  R-EU_R0603  [R0603]
R44  75  R-EU_R0603  [R0603]
R45  75  R-EU_R0603  [R0603]
R46  75  R-EU_R0603  [R0603]
R47  75  R-EU_R0603  [R0603]
R48  33  R-EU_R0603  [R0603]
R49  0  R-EU_R0603  [R0603]
R50  0  R-EU_R0603  [R0603]
R51  270  R-EU_R0603  [R0603]
R52  270  R-EU_R0603  [R0603]
R53  10k  R-EU_R0603  [R0603]
R54  1k5  R-EU_R0603  [R0603]
R55  50  R-EU_R0603  [R0603]
R56  50  R-EU_R0603  [R0603]
R57  50  R-EU_R0603  [R0603]
R58  50  R-EU_R0603  [R0603]
T1  H1102NLT  [XFMR_H1102NLT]
U4  USBLC6-4SC6  [SOT95P280X145-6N]
Y1  ECS-250-20-30B-TR  [XTAL_ECS-250-20-30B-TR]

### Nets
+3V3: C67.1 LAN8742A.9(VDDIO) LBEAD.2 R39.2 R40.2 R42.2 R54.1 ; also sheet 2,4,5,6,8
ETH_CRS_DV: R41.2 ; also sheet 2
ETH_LED1: J3.12 LAN8742A.3(LED1/REGOFF)
ETH_LED2: J3.10 LAN8742A.2(LED2/!NINTSEL!) R53.2
ETH_MDC: LAN8742A.13(MDC) ; also sheet 2
ETH_MDIO: LAN8742A.12(MDIO) R54.2 ; also sheet 2
ETH_REF_CLK: R48.2 ; also sheet 2
ETH_RXD0: R38.2 ; also sheet 2
ETH_RXD1: R37.2 ; also sheet 2
ETH_TX_EN: LAN8742A.16(TXEN) ; also sheet 2
ETH_TXD0: LAN8742A.17(TXD0) ; also sheet 2
ETH_TXD1: LAN8742A.18(TXD1) ; also sheet 2
GND: C21.2 C48.2 C63.- C64.2 C65.2 C66.2 C67.2 C68.2 C69.2 C70.2 C71.2 LAN8742A.25(VSS) R9.2 R43.1 R50.2 R51.1 R52.1 R53.1 U4.2(GND) Y1.2(GND) Y1.4(GND) ; also sheet 2,3,4,5,6,8
N$2: LAN8742A.8(RXD0/MODE0) R38.1 R40.1
N$10: LAN8742A.10(RXER/PHYADO) R9.1
N$12: LAN8742A.11(CRS_DV/MODE2) R39.1 R41.1
N$14: J3.4 J3.5 R45.2
N$16: R47.2 T1.10
N$18: J3.S1 J3.S2 KX7RDBB102.2 R50.1
N$20: J3.9 R51.2
N$56: LAN8742A.7(RXD1/MODE1) R37.1 R42.1
N$61: LAN8742A.14(!NINT!/REFCLKO) R48.1
N$62: C65.1 C66.1 LAN8742A.6(VDDCR)
N$63: LAN8742A.24(RBIAS) R43.2
N$64: J3.7 J3.8 R44.2
N$66: KX7RDBB102.1 R44.1 R45.1 R46.1 R47.1
N$67: LAN8742A.15(!NRST) R49.2
N$70: J3.1 T1.16
N$71: R46.2 T1.15
N$72: J3.2 T1.14
N$73: J3.3 T1.11
N$75: J3.6 T1.9
N$77: J3.11 R52.2
NRST: R49.1 ; also sheet 2
RXN: LAN8742A.22(RXN) R58.2 T1.8 U4.6(IO4)
RXP: LAN8742A.23(RXP) R57.2 T1.6 U4.1(IO1)
TXN: LAN8742A.20(TXN) R56.2 T1.3 U4.4(IO3)
TXP: LAN8742A.21(TXP) R55.2 T1.1 U4.3(IO2)
VDD_ETH: C21.1 C48.1 C63.+ C64.1 C68.1 C71.1 LAN8742A.1(VDD2A) LAN8742A.19(VDD1A) LBEAD.1 R55.1 R56.1 R57.1 R58.1 T1.2 T1.7 U4.5(VBUS)
X1: C70.1 LAN8742A.5(XTAL1/CLKLN) Y1.1(IN/OUT)
X2: C69.1 LAN8742A.4(XTAL2) Y1.3(OUT/IN)

## Sheet 8 of 8
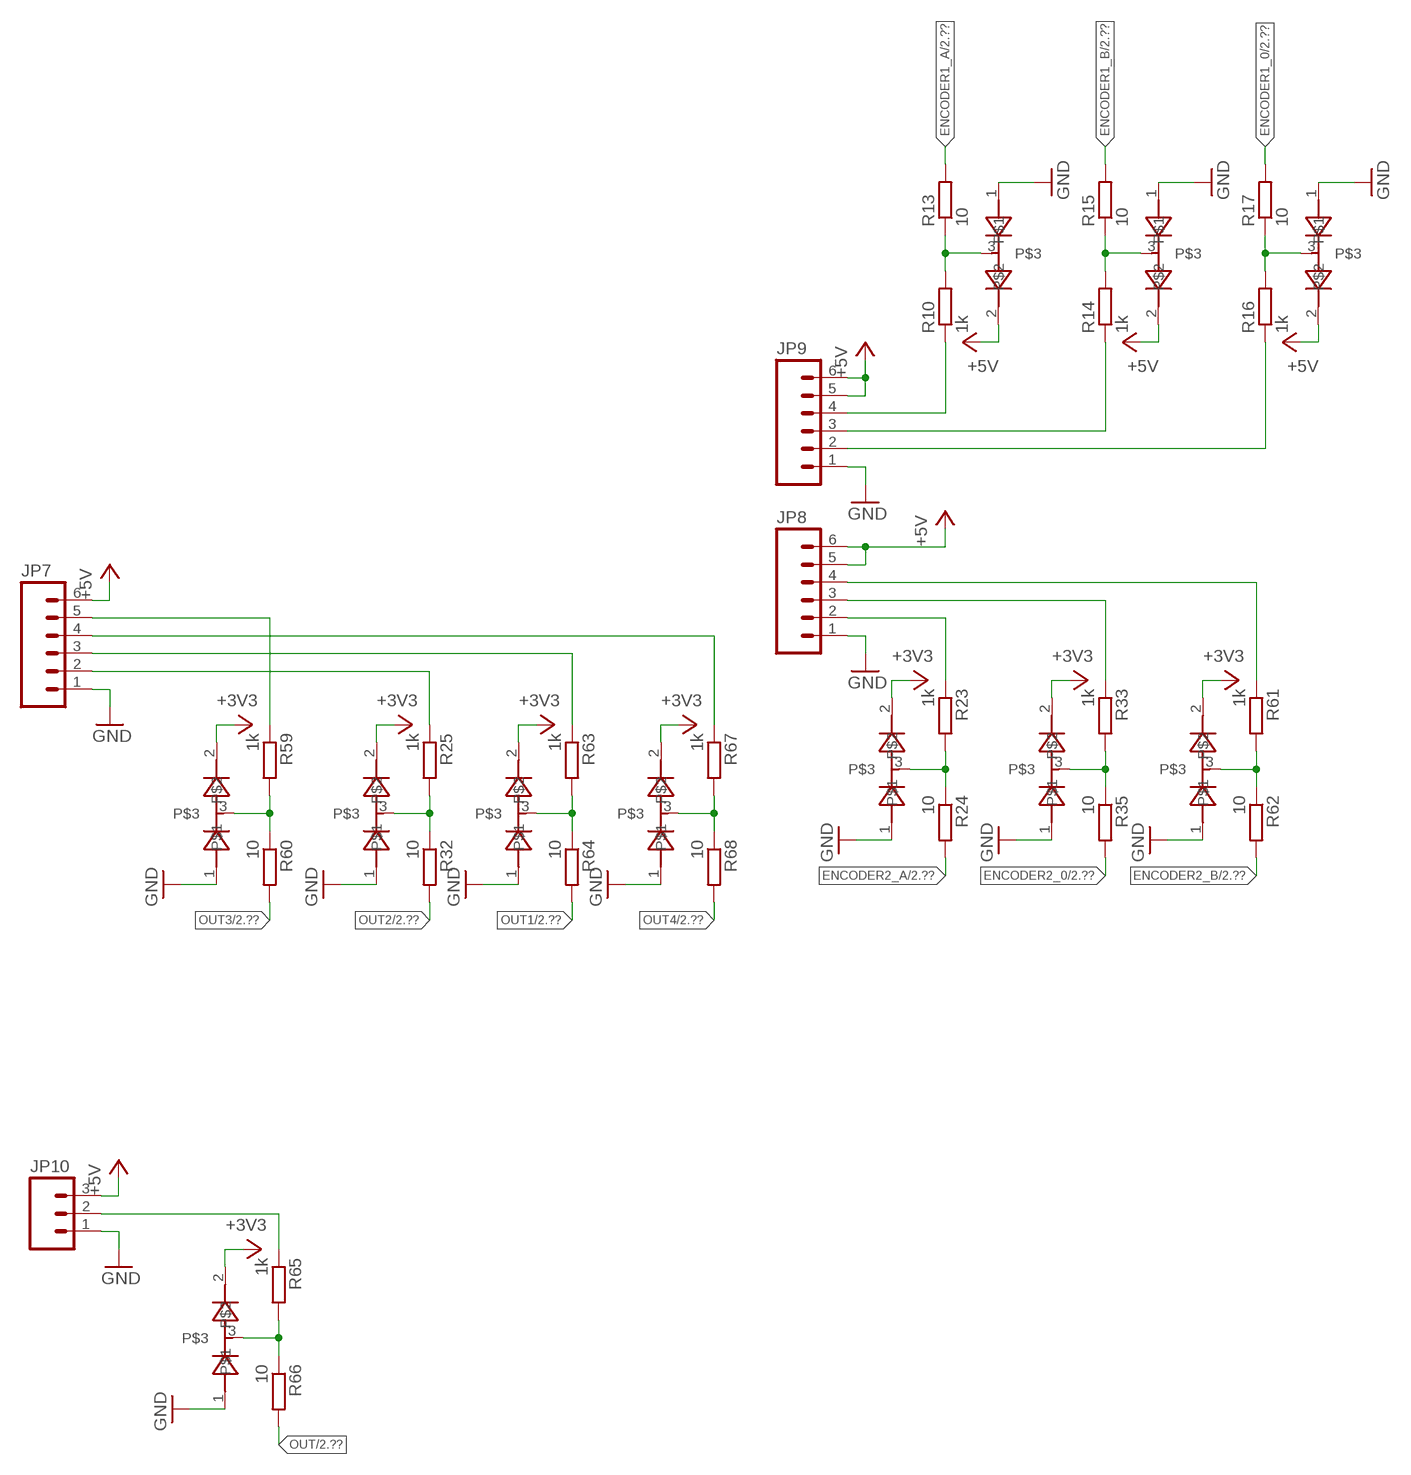
[diagram p8: schematic, sheet 8]

### Parts
JP7  M063.5MM-6  [SCREWTERMINAL-3.5MM-6]
JP8  M063.5MM-6  [SCREWTERMINAL-3.5MM-6]
JP9  M063.5MM-6  [SCREWTERMINAL-3.5MM-6]
JP10  M03SCREW  [SCREWTERMINAL-3.5MM-3]
R10  1k  R-EU_R0603  [R0603]
R13  10  R-EU_R0603  [R0603]
R14  1k  R-EU_R0603  [R0603]
R15  10  R-EU_R0603  [R0603]
R16  1k  R-EU_R0603  [R0603]
R17  10  R-EU_R0603  [R0603]
R23  1k  R-EU_R0603  [R0603]
R24  10  R-EU_R0603  [R0603]
R25  1k  R-EU_R0603  [R0603]
R32  10  R-EU_R0603  [R0603]
R33  1k  R-EU_R0603  [R0603]
R35  10  R-EU_R0603  [R0603]
R59  1k  R-EU_R0603  [R0603]
R60  10  R-EU_R0603  [R0603]
R61  1k  R-EU_R0603  [R0603]
R62  10  R-EU_R0603  [R0603]
R63  1k  R-EU_R0603  [R0603]
R64  10  R-EU_R0603  [R0603]
R65  1k  R-EU_R0603  [R0603]
R66  10  R-EU_R0603  [R0603]
R67  1k  R-EU_R0603  [R0603]
R68  10  R-EU_R0603  [R0603]
U$6  BAS40W-04  [SOT65P210X110-3N]
U$8  BAS40W-04  [SOT65P210X110-3N]
U$9  BAS40W-04  [SOT65P210X110-3N]
U$10  BAS40W-04  [SOT65P210X110-3N]
U$11  BAS40W-04  [SOT65P210X110-3N]
U$12  BAS40W-04  [SOT65P210X110-3N]
U$13  BAS40W-04  [SOT65P210X110-3N]
U$14  BAS40W-04  [SOT65P210X110-3N]
U$15  BAS40W-04  [SOT65P210X110-3N]
U$16  BAS40W-04  [SOT65P210X110-3N]
U$17  BAS40W-04  [SOT65P210X110-3N]

### Nets
+3V3: U$10.2 U$11.2 U$12.2 U$13.2 U$14.2 U$15.2 U$16.2 U$17.2 ; also sheet 2,4,5,6,7
+5V: JP7.6 JP8.5 JP8.6 JP9.5 JP9.6 JP10.3 U$6.2 U$8.2 U$9.2 ; also sheet 2,4
ENCODER1_0: R17.2 ; also sheet 2
ENCODER1_A: R13.2 ; also sheet 2
ENCODER1_B: R15.2 ; also sheet 2
ENCODER2_0: R35.2 ; also sheet 2
ENCODER2_A: R24.2 ; also sheet 2
ENCODER2_B: R62.2 ; also sheet 2
GND: JP7.1 JP8.1 JP9.1 JP10.1 U$6.1 U$8.1 U$9.1 U$10.1 U$11.1 U$12.1 U$13.1 U$14.1 U$15.1 U$16.1 U$17.1 ; also sheet 2,3,4,5,6,7
N$21: JP8.2 R23.1
N$29: JP8.3 R33.1
N$30: JP7.5 R59.1
N$33: R10.2 R13.1 U$6.3
N$39: JP9.4 R10.1
N$40: JP8.4 R61.1
N$45: R16.2 R17.1 U$9.3
N$46: R14.2 R15.1 U$8.3
N$53: JP9.3 R14.1
N$54: R25.2 R32.1 U$11.3
N$57: JP9.2 R16.1
N$65: R23.2 R24.1 U$10.3
N$68: JP7.2 R25.1
N$76: JP7.3 R63.1
N$80: JP7.4 R67.1
N$81: R65.2 R66.1 U$16.3
N$83: JP10.2 R65.1
N$84: R33.2 R35.1 U$12.3
N$85: R59.2 R60.1 U$13.3
N$88: R63.2 R64.1 U$15.3
N$92: R61.2 R62.1 U$14.3
N$97: R67.2 R68.1 U$17.3
OUT: R66.2 ; also sheet 2
OUT1: R64.2 ; also sheet 2
OUT2: R32.2 ; also sheet 2
OUT3: R60.2 ; also sheet 2
OUT4: R68.2 ; also sheet 2

## Library data of the parts
BT1 = 3000TR:3000TR: Ultra Low Profile SMT Coin Cell Battery Contact Retainer for 12 mm Cell; AVAILABILITY: Unavailable; DESCRIPTION: Ultra Low Profile SMT Coin Cell Battery Contact Retainer for 12 mm Cell; MF: Keystone; MP: 3000TR; PACKAGE: None; PRICE: None
C1-C62 C64-C72 C84-C90 C92-C94 KX7RDBB102 = rcl:C-EU: CAPACITOR, European symbol
C63 C91 = rcl:CPOL-EU: POLARIZED CAPACITOR, European symbol; SPICEPREFIX: C
D1 = diode:DIODE-: DIODE
ESDA6V1BC6 = ESDA6V1SC6:ESDA6V1SC6: ESDA Series 4 Channel 6.1V 190 pF SMT Uni Directional Transil Array - SOT-23-6; AVAILABILITY: Unavailable; MF: STMicroelectronics; MP: ESDA6V1SC6; PACKAGE: SOT-23-6 STMicroelectronics; PRICE: None
J3 = RJHSE-5381:RJHSE-5381: connector, mod jack, rt angle pcb, shielded, led1-g, led2-y, single port, rj-45 8 cont; AVAILABILITY: Unavailable; DESCRIPTION: connector, mod jack, rt angle pcb, shielded, led1-g, led2-y, single port, rj-45 8 cont; MF: Amphenol ICC; MP: RJHSE-5381; PACKAGE: None; PRICE: None
JP1-JP3 JP7-JP9 = SparkFun (1):M06: Header 6 Standard 6-pin 0.1" header. Use with straight break away headers (SKU : PRT-00116), right angle break away headers (PRT-00553), swiss pins (PRT-00743), machine pins (PRT-00117), and female headers (PRT-00115). Molex polarized connector foot print use with SKU : PRT-08094 with associated crimp pins and housings. NOTES ON THE VARIANTS LOCK and LOCK_LONGPADS... This footprint was designed to help hold the alignment of a through-hole component (i.e. 6-pin header) while soldering it into place. You may notice that each hole has been shifted either up or down by 0.005 of an inch from it's more standard position (which is a perfectly straight line). This slight alteration caused the pins (the squares in the middle) to touch the edges of the holes. Because they are alternating, it causes a "brace" to hold the component in place. 0.005 has proven to be the perfect amount of "off-center" position when using our standard breakaway headers. Although looks a little odd when you look at the bare footprint, once you have a header in there, the alteration is very hard to notice. Also, if you push a header all the way into place, it is covered up entirely on the bottom side. This idea of altering the position of holes to aid alignment will be further integrated into the Sparkfun Library for other footprints. It can help hold any component with 3 or more connection pins.
JP4 JP10 = SparkFun:M03: Header 3 Standard 3-pin 0.1" header. Use with straight break away headers (SKU : PRT-00116), right angle break away headers (PRT-00553), swiss pins (PRT-00743), machine pins (PRT-00117), and female headers (PRT-00115). Molex polarized connector foot print use with SKU : PRT-08232 with associated crimp pins and housings.
JP6 = SparkFun:M02: Header 2 Standard 2-pin 0.1" header. Use with straight break away headers (SKU : PRT-00116), right angle break away headers (PRT-00553), swiss pins (PRT-00743), machine pins (PRT-00117), and female headers (PRT-00115). Molex polarized connector foot print use with SKU : PRT-08233 with associated crimp pins and housings.
L1 = inductors:DR74: High Power Density, High Efficiency, Shielded Inductors Source: coiltronics_dr_series.pdf; SPICEPREFIX: L
LAN8742A = LAN87xxA-CP:LAN8720A-CP: LAN8720A Series 3.3 V RMII 10/100 Ethernet Transceiver Surface Mount - QFN-24; AVAILABILITY: Unavailable; DESCRIPTION: Txrx Ethernet 10/100 Rmii - Lan8720a-Cp; MF: SMSC; MP: LAN8720A-CP; PACKAGE: QFN-24 SMSC; PRICE: None
LBEAD R R1-R71 RDAMP RSET RT0805BRD072K05L = rcl:R-EU_: RESISTOR, European symbol
LED1-LED6 = led:LED: LED OSRAM: - CHIPLED LG R971, LG N971, LY N971, LG Q971, LY Q971, LO R971, LY R971 LH N974, LH R974 LS Q976, LO Q976, LY Q976 LO Q996 - Hyper CHIPLED LW Q18S LB Q993, LB Q99A, LB R99A - SideLED LS A670, LO A670, LY A670, LG A670, LP A670 LB A673, LV A673, LT A673, LW A673 LH A674 LY A675 LS A676, LA A676, LO A676, LY A676, LW A676 LS A679, LY A679, LG A679 - Hyper Micro SIDELED® LS Y876, LA Y876, LO Y876, LY Y876 LT Y87S - SmartLED LW L88C, LW L88S LB L89C, LB L89S, LG L890 LS L89K, LO L89K, LY L89K LS L896, LA L896, LO L896, LY L896 - TOPLED LS T670, LO T670, LY T670, LG T670, LP T670 LSG T670, LSP T670, LSY T670, LOP T670, LYG T670 LG T671, LOG T671, LSG T671 LB T673, LV T673, LT T673, LW T673 LH T674 LS T676, LA T676, LO T676, LY T676, LB T676, LH T676, LSB T676, LW T676 LB T67C, LV T67C, LT T67C, LS T67K, LO T67K, LY T67K, LW E67C LS E67B, LA E67B, LO E67B, LY E67B, LB E67C, LV E67C, LT E67C LW T67C LS T679, LY T679, LG T679 LS T770, LO T770, LY T770, LG T770, LP T770 LB T773, LV T773, LT T773, LW T773 LH T774 LS E675, LA E675, LY E675, LS T675 LS T776, LA T776, LO T776, LY T776, LB T776 LHGB T686 LT T68C, LB T68C - Hyper Mini TOPLED® LB M676 - Mini TOPLED Santana® LG M470 LS M47K, LO M47K, LY M47K Source: http://www.osram.convergy.de LUXEON: - LUMILED® LXK2-PW12-R00, LXK2-PW12-S00, LXK2-PW14-U00, LXK2-PW14-V00 LXK2-PM12-R00, LXK2-PM12-S00, LXK2-PM14-U00 LXK2-PE12-Q00, LXK2-PE12-R00, LXK2-PE12-S00, LXK2-PE14-T00, LXK2-PE14-U00 LXK2-PB12-K00, LXK2-PB12-L00, LXK2-PB12-M00, LXK2-PB14-N00, LXK2-PB14-P00, LXK2-PB14-Q00 LXK2-PR12-L00, LXK2-PR12-M00, LXK2-PR14-Q00, LXK2-PR14-R00 LXK2-PD12-Q00, LXK2-PD12-R00, LXK2-PD12-S00 LXK2-PH12-R00, LXK2-PH12-S00 LXK2-PL12-P00, LXK2-PL12-Q00, LXK2-PL12-R00 Source: www.luxeon.com KINGBRIGHT: KA-3528ASYC Source: www.kingbright.com
Q1 = transistor-fet:BSP170P: SIPMOS(R) Small-Signal-Transistor P-Channel, Enhancement mode Source: http://www.infineon.com/upload/Document/BSP170P_Rev2.4.pdf
Q2 = transistor-pnp:MMBT2907*: PNP Transistror
S1 = KMR221GLFS:KMR221GLFS: Switch Tactile N.O. SPST Button Gull Wing 0.05A 32VDC 1VA 200000Cycles 2N SMD Automotive T/R; AVAILABILITY: Good; DESCRIPTION: Switch Tactile N.O. SPST Button Gull Wing 0.05A 32VDC 1VA 200000Cycles 2N SMD Automotive T/R; MF: C&K Components; MP: KMR221GLFS; PACKAGE: None; PRICE: 0.28 USD
SJ1-SJ3 = SparkFun:SOLDERJUMPER_2WAY: Solder Jumper 2 way solder jumper
T1 = H1102NLT:H1102NLT: Telecom Transformer 1: 1/1: 1 0.65Ohm Prim. DCR 0.65Ohm Sec. DCR 16Term. Gull Wing SMD; AVAILABILITY: Unavailable; DESCRIPTION: Telecom Transformer 1: 1/1: 1 0.65Ohm Prim. DCR 0.65Ohm Sec. DCR 16Term. Gull Wing SMD; MF: Pulse Electronics; MP: H1102NLT; PACKAGE: Pulse Electronics; PRICE: None
U1 = LTC2983CLX_PBF:LTC2983CLX#PBF: LTC2983 - Multi-Sensor High Accuracy Digital Temperature Measurement System; AVAILABILITY: Unavailable; DESCRIPTION: LTC2983 - Multi-Sensor High Accuracy Digital Temperature Measurement System; MF: Linear Technology/Analog; MP: LTC2983CLX#PBF; PACKAGE: LQFP-48 Linear Technology; PRICE: None
U2 = XTR111AIDGQR:XTR111AIDGQR: Precision Voltage-to-Current Converter/Transmitter; AVAILABILITY: Unavailable; DESCRIPTION: Precision Voltage To Current Converter/Transmitter 10-Pin HTSSOP EP T/R; MF: Texas Instruments; MP: XTR111AIDGQR; PACKAGE: TFSOP-10 Texas Instruments; PRICE: None
U3 U5 = MCP1826S-5002E_DB:MCP1826S-5002E/DB: IC, LDO, 5V, 1A; AVAILABILITY: Unavailable; DESCRIPTION: MCP1826S Series 1 A 5 V Fixed Output Surface Mount LDO Regulator - SOT-223; MF: Microchip; MP: MCP1826S-5002E/DB; PACKAGE: SOT-223-3 Microchip; PRICE: None
U4 = USBLC6-4SC6:USBLC6-4SC6: None; AVAILABILITY: Unavailable; DESCRIPTION: USBLC6 Series 4 Line 6 V Uni / Bi Directional ESD Protection - SOT23-6; MF: STMicroelectronics; MP: USBLC6-4SC6; PACKAGE: SOT-23-6 STMicroelectronics; PRICE: None
U6 = TPS54531DDA:TPS54531DDA: 3.5V to 28V Input, 5A, 570kHz Step-Down Converter with Eco-mode 8-SO PowerPAD -40 to 85; AVAILABILITY: Unavailable; DESCRIPTION: 3.5V to 28V Input, 5A, 570kHz Step-Down Converter with Eco-mode 8-SO PowerPAD -40 to 85; MF: Texas Instruments; MP: TPS54531DDA; PACKAGE: SO-8 Texas Instruments; PRICE: None
U$1 = TSOP54:IS45S16400J
U$2 = IFX5444:IFX5444
U$3 = STM32F429_176:STM32F429_176
U$4 = s25FL:S25FLX
U$5 = Micromatch:MICROMATCH_8
U$6 U$8-U$17 = BAS40w-0:BAS40W-04
X1 = con-hirose:FH12-40S-0.5S: 0.5mm Pitch Connectors For FPC/FFC Source: Data sheet <http://www.hirose.co.jp/cataloge_hp/e58605370.pdf>; MPN: FH12-40S-0.5SH(55); OC_FARNELL: 1324556; OC_NEWARK: 34M6178
X4 = con-cypressindustries:MINI-USB-: MINI USB-B Conector Source: www.cypressindustries.com; OC_FARNELL: unknown; OC_NEWARK: unknown
Y1 = ECS-250-20-30B-TR:ECS-250-20-30B-TR: The ECX-53B is a miniature SMD Crystal with a 3.2 x 5 mm footprint. This package is ideal for todays compact wireless applications where board space is critical.; AVAILABILITY: Unavailable; DESCRIPTION: Crystal 25MHz ±30ppm _Tol_ ±50ppm _Stability_ 20pF FUND 30Ohm 4-Pin Mini-SMD T/R; MF: ECS Inc.; MP: ECS-250-20-30B-TR; PACKAGE: SMD-4 ECS International; PRICE: None